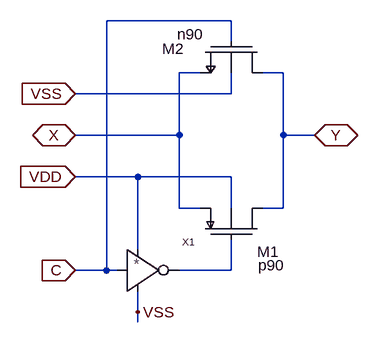
[diagram p0: schematic tgate.asc]
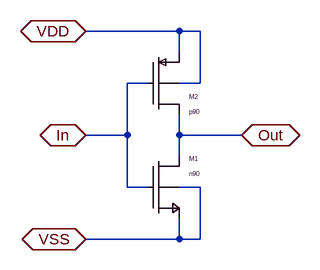
[diagram p1: sub-circuit inv.asc]
tgate.asc, the LTspice schematic file:
Version 4
SHEET 1 904 704
WIRE 336 0 144 0
WIRE 336 32 336 0
WIRE 288 80 256 80
WIRE 416 80 384 80
WIRE 336 112 336 80
WIRE 336 112 96 112
WIRE 256 176 256 80
WIRE 256 176 96 176
WIRE 416 176 416 80
WIRE 464 176 416 176
WIRE 192 240 96 240
WIRE 336 240 192 240
WIRE 256 288 256 176
WIRE 288 288 256 288
WIRE 336 288 336 240
WIRE 416 288 416 176
WIRE 416 288 384 288
WIRE 192 352 192 240
WIRE 144 384 144 0
WIRE 144 384 96 384
WIRE 160 384 144 384
WIRE 336 384 336 336
WIRE 336 384 256 384
WIRE 192 448 192 416
WIRE 192 464 192 448
FLAG 96 176 X
IOPIN 96 176 BiDir
FLAG 464 176 Y
IOPIN 464 176 BiDir
FLAG 96 240 VDD
IOPIN 96 240 In
FLAG 96 384 C
IOPIN 96 384 In
FLAG 96 112 VSS
IOPIN 96 112 In
FLAG 192 448 VSS
SYMBOL pmosb 288 336 R270
WINDOW 0 -19 88 VRight 0
WINDOW 3 -40 89 VRight 0
SYMATTR InstName M1
SYMATTR Value p90
SYMATTR Value2 l=0.25u w=20u m=10
SYMBOL nmosb 384 32 R90
WINDOW 0 11 121 VRight 0
WINDOW 3 -11 91 VRight 0
SYMATTR InstName M2
SYMATTR Value n90
SYMATTR Value2 l=0.25u w=10u m=10
SYMBOL inv 176 336 R0
SYMATTR InstName X1

inv.asc, the sub-circuit schematic file:
Version 4
SHEET 1 880 680
WIRE 192 16 48 16
WIRE 224 16 192 16
WIRE 192 48 192 16
WIRE 144 96 112 96
WIRE 224 96 224 16
WIRE 224 96 192 96
WIRE 112 176 112 96
WIRE 112 176 48 176
WIRE 192 176 192 144
WIRE 288 176 192 176
WIRE 192 208 192 176
WIRE 112 256 112 176
WIRE 144 256 112 256
WIRE 224 256 192 256
WIRE 192 336 192 304
WIRE 192 336 48 336
WIRE 224 336 224 256
WIRE 224 336 192 336
FLAG 48 16 VDD
IOPIN 48 16 BiDir
FLAG 48 336 VSS
IOPIN 48 336 BiDir
FLAG 48 176 In
IOPIN 48 176 BiDir
FLAG 288 176 Out
IOPIN 288 176 BiDir
SYMBOL nmosb 144 208 R0
SYMATTR InstName M1
SYMATTR Value n90
SYMATTR Value2 l=0.25u w=2u m=1
SYMBOL pmosb 144 48 R0
SYMATTR InstName M2
SYMATTR Value p90
SYMATTR Value2 l=0.25u w=4u m=1

The netlist it stands for:
* tgate.asc
M1 Y N001 X VDD p90 l=0.25u w=20u m=10
M2 Y C X VSS n90 l=0.25u w=10u m=10
XX1 C VDD N001 VSS inv

* block symbol definitions
.subckt inv In VDD Out VSS
M1 Out In VSS VSS n90 l=0.25u w=2u m=1
M2 Out In VDD VDD p90 l=0.25u w=4u m=1
.ends inv

.model NMOS NMOS
.model PMOS PMOS
.lib standard.mos
.backanno
.end